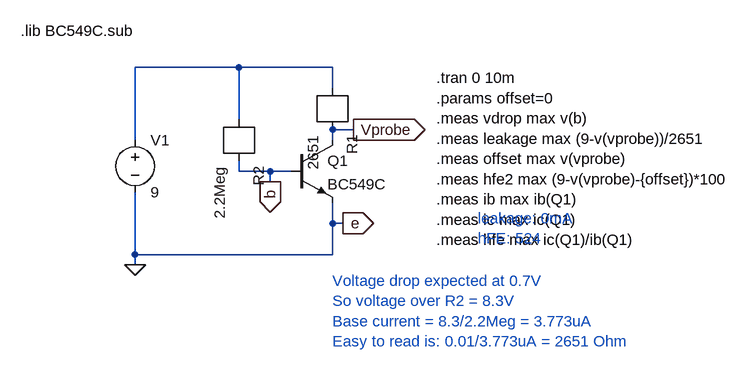
[diagram p0: schematic BC549C-hFE.asc]
BC549C-hFE.asc, the LTspice schematic file:
Version 4
SHEET 1 880 680
WIRE -32 96 -192 96
WIRE 112 96 -32 96
WIRE 112 128 112 96
WIRE -32 176 -32 96
WIRE 144 192 112 192
WIRE -192 208 -192 96
WIRE 112 208 112 192
WIRE -32 256 -32 240
WIRE 16 256 -32 256
WIRE 48 256 16 256
WIRE 16 272 16 256
WIRE 112 336 112 304
WIRE 128 336 112 336
WIRE -192 384 -192 288
WIRE 112 384 112 336
WIRE 112 384 -192 384
WIRE -192 400 -192 384
FLAG -192 400 0
FLAG 144 192 Vprobe
IOPIN 144 192 Out
FLAG 128 336 e
IOPIN 128 336 Out
FLAG 16 272 b
IOPIN 16 272 Out
SYMBOL npn 48 208 R0
SYMATTR InstName Q1
SYMATTR Value BC549C
SYMBOL voltage -192 192 R0
SYMATTR InstName V1
SYMATTR Value 9
SYMBOL r -32 176 R90
SYMATTR InstName R2
SYMATTR Value 2.2Meg
SYMBOL r 112 128 R90
SYMATTR InstName R1
SYMATTR Value 2651
TEXT -368 40 Left 2 !.lib BC549C.sub
TEXT 272 112 Left 2 !.tran 0 10m\n.params offset=0\n.meas vdrop max v(b)\n.meas leakage max (9-v(vprobe))/2651\n.meas offset max v(vprobe)\n.meas hfe2 max (9-v(vprobe)-{offset})*100\n.meas ib max ib(Q1)\n.meas ic max ic(Q1)\n.meas hfe max ic(Q1)/ib(Q1)
TEXT 336 328 Left 2 ;leakage: 0mA\nhFE: 524
TEXT 112 424 Left 2 ;Voltage drop expected at 0.7V\nSo voltage over R2 = 8.3V\nBase current = 8.3/2.2Meg = 3.773uA\nEasy to read is: 0.01/3.773uA = 2651 Ohm

The netlist it stands for:
* BC549C-hFE.asc
Q1 Vprobe b 0 0 BC549C
V1 N001 0 9
R2 b N001 2.2Meg
R1 Vprobe N001 2651
.model NPN NPN
.model PNP PNP
.lib standard.bjt
.lib BC549C.sub
.tran 0 10m
.params offset=0
.meas vdrop max v(b)
.meas leakage max (9-v(vprobe))/2651
.meas offset max v(vprobe)
.meas hfe2 max (9-v(vprobe)-{offset})*100
.meas ib max ib(Q1)
.meas ic max ic(Q1)
.meas hfe max ic(Q1)/ib(Q1)
* leakage: 0mA
* hFE: 524
* Voltage drop expected at 0.7V
* So voltage over R2 = 8.3V
* Base current = 8.3/2.2Meg = 3.773uA
* Easy to read is: 0.01/3.773uA = 2651 Ohm
.backanno
.end